# Altium schematic sheet HS-IO Inputs.SchDoc
size A3; SheetNumber: 1; SheetTotal: 3
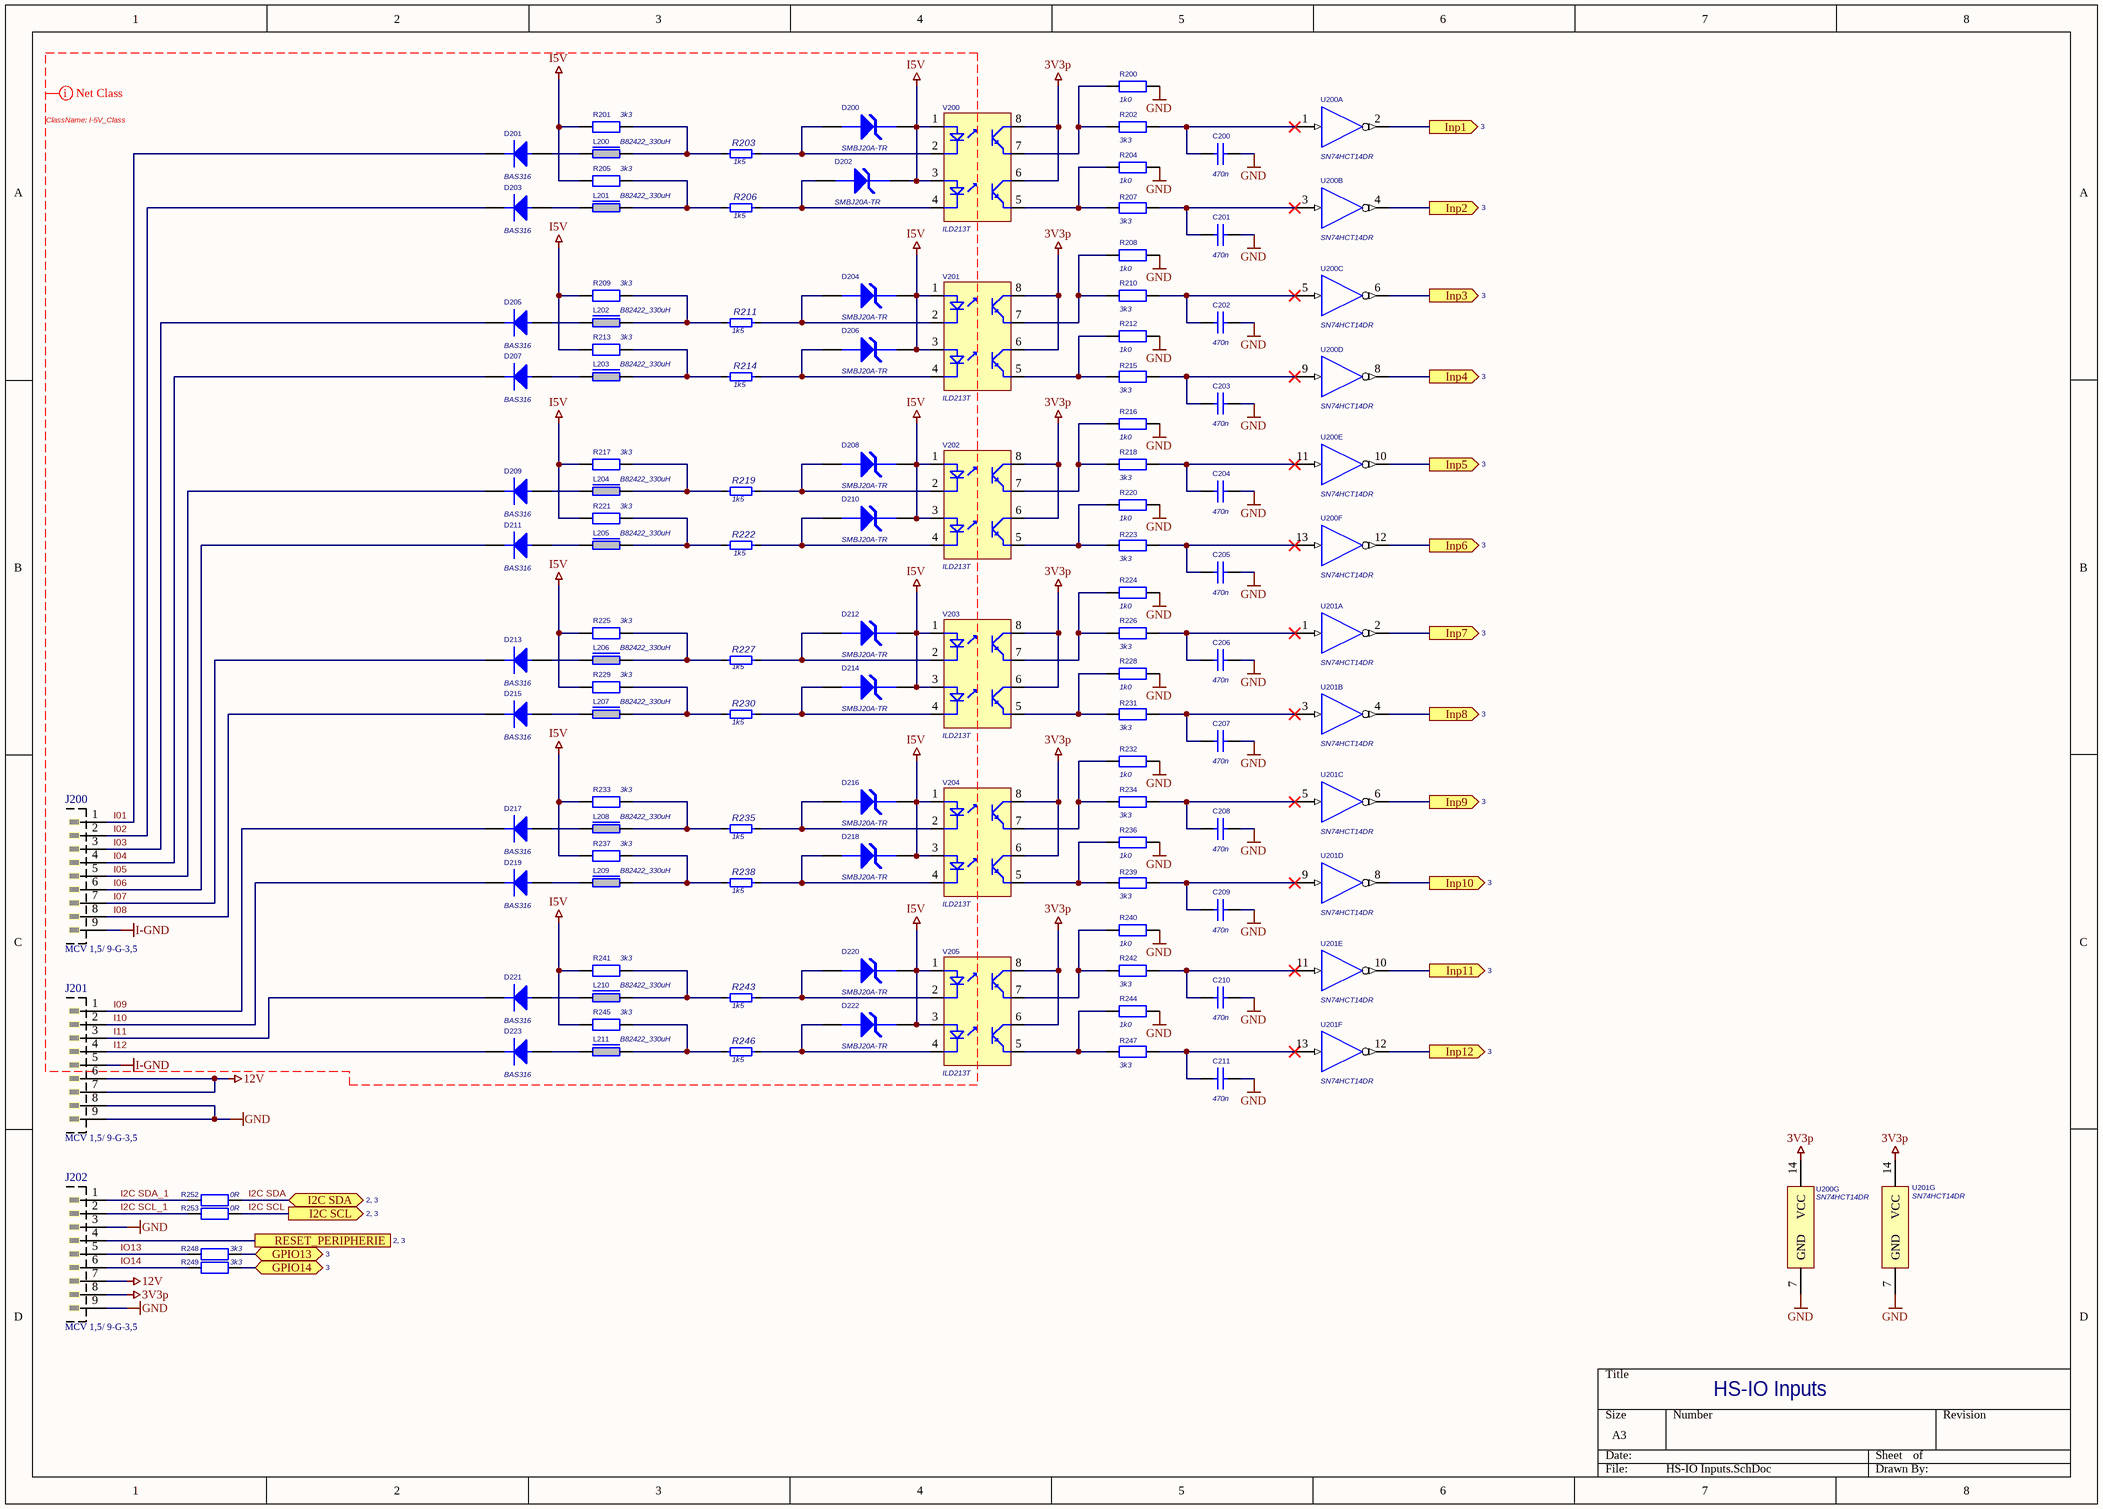
[diagram p0: HS-IO Inputs.SchDoc]

## Parts
C200  470n  [CC1608-0603]
C201  470n  [CC1608-0603]
C202  470n  [CC1608-0603]
C203  470n  [CC1608-0603]
C204  470n  [CC1608-0603]
C205  470n  [CC1608-0603]
C206  470n  [CC1608-0603]
C207  470n  [CC1608-0603]
C208  470n  [CC1608-0603]
C209  470n  [CC1608-0603]
C210  470n  [CC1608-0603]
C211  470n  [CC1608-0603]
D200  SMBJ20A-TR  [SMB]
D201  BAS316  [SOD323F]
D202  SMBJ20A-TR  [SMB]
D203  BAS316  [SOD323F]
D204  SMBJ20A-TR  [SMB]
D205  BAS316  [SOD323F]
D206  SMBJ20A-TR  [SMB]
D207  BAS316  [SOD323F]
D208  SMBJ20A-TR  [SMB]
D209  BAS316  [SOD323F]
D210  SMBJ20A-TR  [SMB]
D211  BAS316  [SOD323F]
D212  SMBJ20A-TR  [SMB]
D213  BAS316  [SOD323F]
D214  SMBJ20A-TR  [SMB]
D215  BAS316  [SOD323F]
D216  SMBJ20A-TR  [SMB]
D217  BAS316  [SOD323F]
D218  SMBJ20A-TR  [SMB]
D219  BAS316  [SOD323F]
D220  SMBJ20A-TR  [SMB]
D221  BAS316  [SOD323F]
D222  SMBJ20A-TR  [SMB]
D223  BAS316  [SOD323F]
J200  MCV 1,5/ 9-G-3,5  [MCV1,5/9-G-3,5 - I]
J201  MCV 1,5/ 9-G-3,5  [MCV1,5/9-G-3,5 - I]
J202  MCV 1,5/ 9-G-3,5  [MCV1,5/9-G-3,5 - I]
L200  B82422_330uH  [CR3225-1210]
L201  B82422_330uH  [CR3225-1210]
L202  B82422_330uH  [CR3225-1210]
L203  B82422_330uH  [CR3225-1210]
L204  B82422_330uH  [CR3225-1210]
L205  B82422_330uH  [CR3225-1210]
L206  B82422_330uH  [CR3225-1210]
L207  B82422_330uH  [CR3225-1210]
L208  B82422_330uH  [CR3225-1210]
L209  B82422_330uH  [CR3225-1210]
L210  B82422_330uH  [CR3225-1210]
L211  B82422_330uH  [CR3225-1210]
R200  1k0  [CR1608-0603]
R201  3k3  [CR1608-0603]
R202  3k3  [CR1608-0603]
R203  1k5  [CR1608-0603]
R204  1k0  [CR1608-0603]
R205  3k3  [CR1608-0603]
R206  1k5  [CR1608-0603]
R207  3k3  [CR1608-0603]
R208  1k0  [CR1608-0603]
R209  3k3  [CR1608-0603]
R210  3k3  [CR1608-0603]
R211  1k5  [CR1608-0603]
R212  1k0  [CR1608-0603]
R213  3k3  [CR1608-0603]
R214  1k5  [CR1608-0603]
R215  3k3  [CR1608-0603]
R216  1k0  [CR1608-0603]
R217  3k3  [CR1608-0603]
R218  3k3  [CR1608-0603]
R219  1k5  [CR1608-0603]
R220  1k0  [CR1608-0603]
R221  3k3  [CR1608-0603]
R222  1k5  [CR1608-0603]
R223  3k3  [CR1608-0603]
R224  1k0  [CR1608-0603]
R225  3k3  [CR1608-0603]
R226  3k3  [CR1608-0603]
R227  1k5  [CR1608-0603]
R228  1k0  [CR1608-0603]
R229  3k3  [CR1608-0603]
R230  1k5  [CR1608-0603]
R231  3k3  [CR1608-0603]
R232  1k0  [CR1608-0603]
R233  3k3  [CR1608-0603]
R234  3k3  [CR1608-0603]
R235  1k5  [CR1608-0603]
R236  1k0  [CR1608-0603]
R237  3k3  [CR1608-0603]
R238  1k5  [CR1608-0603]
R239  3k3  [CR1608-0603]
R240  1k0  [CR1608-0603]
R241  3k3  [CR1608-0603]
R242  3k3  [CR1608-0603]
R243  1k5  [CR1608-0603]
R244  1k0  [CR1608-0603]
R245  3k3  [CR1608-0603]
R246  1k5  [CR1608-0603]
R247  3k3  [CR1608-0603]
R248  3k3  [CR1608-0603]
R249  3k3  [CR1608-0603]
R252  0R  [CR1608-0603]
R253  0R  [CR1608-0603]
U200  SN74HCT14DR  [SO14]  (parts A,B,C,D,E,F,G of 7)
U201  SN74HCT14DR  [SO14]  (parts A,B,C,D,E,F,G of 7)
V200  ILD213T  [SOIC8]
V201  ILD213T  [SOIC8]
V202  ILD213T  [SOIC8]
V203  ILD213T  [SOIC8]
V204  ILD213T  [SOIC8]
V205  ILD213T  [SOIC8]

## Ports
GPIO13 (bidir, see 3), GPIO14 (bidir, see 3), I2C SCL (out, see 2, 3), I2C SDA (bidir, see 2, 3), Inp1 (out, see 3), Inp2 (out, see 3), Inp3 (out, see 3), Inp4 (out, see 3), Inp5 (out, see 3), Inp6 (out, see 3), Inp7 (out, see 3), Inp8 (out, see 3), Inp9 (out, see 3), Inp10 (out, see 3), Inp11 (out, see 3), Inp12 (out, see 3), RESET_PERIPHERIE (see 2, 3)

## Nets
3V3p: J202.8 U200.14(VCC) U201.14(VCC) V200.6 V200.8(Vcc) V201.6 V201.8(Vcc) V202.6 V202.8(Vcc) V203.6 V203.8(Vcc) V204.6 V204.8(Vcc) V205.6 V205.8(Vcc)
12V: J201.6 J201.7 J202.7
GND: C200.2 C201.2 C202.2 C203.2 C204.2 C205.2 C206.2 C207.2 C208.2 C209.2 C210.2 C211.2 J201.8 J201.9 J202.3 J202.9 R200.2 R204.2 R208.2 R212.2 R216.2 R220.2 R224.2 R228.2 R232.2 R236.2 R240.2 R244.2 U200.7(GND) U201.7(GND)
I5V: D200.2(K) D202.2(K) D204.2(K) D206.2(K) D208.2(K) D210.2(K) D212.2(K) D214.2(K) D216.2(K) D218.2(K) D220.2(K) D222.2(K) R201.1 R205.1 R209.1 R213.1 R217.1 R221.1 R225.1 R229.1 R233.1 R237.1 R241.1 R245.1 V200.1 V200.3 V201.1 V201.3 V202.1 V202.3 V203.1 V203.3 V204.1 V204.3 V205.1 V205.3
I-GND: J200.9 J201.5
GPIO13: R248.2 ; port GPIO13
GPIO14: R249.2 ; port GPIO14
I01: D201.2(K) J200.1
I02: D203.2(K) J200.2
I2C SCL: R253.2 ; port I2C SCL
I2C SCL_1: J202.2 R253.1
I2C SDA: R252.2 ; port I2C SDA
I2C SDA_1: J202.1 R252.1
I03: D205.2(K) J200.3
I04: D207.2(K) J200.4
I05: D209.2(K) J200.5
I06: D211.2(K) J200.6
I07: D213.2(K) J200.7
I08: D215.2(K) J200.8
I09: D217.2(K) J201.1
I10: D219.2(K) J201.2
I11: D221.2(K) J201.3
I12: D223.2(K) J201.4
Inp1: U200.2(Y) ; port Inp1
Inp2: U200.4(Y) ; port Inp2
Inp3: U200.6(Y) ; port Inp3
Inp4: U200.8(Y) ; port Inp4
Inp5: U200.10(Y) ; port Inp5
Inp6: U200.12(Y) ; port Inp6
Inp7: U201.2(Y) ; port Inp7
Inp8: U201.4(Y) ; port Inp8
Inp9: U201.6(Y) ; port Inp9
Inp10: U201.8(Y) ; port Inp10
Inp11: U201.10(Y) ; port Inp11
Inp12: U201.12(Y) ; port Inp12
IO13: J202.5 R248.1
IO14: J202.6 R249.1
RESET_PERIPHERIE: J202.4 ; port RESET_PERIPHERIE
NetC200_1: C200.1 R202.2 U200.1(A)
NetC201_1: C201.1 R207.2 U200.3(A)
NetC202_1: C202.1 R210.2 U200.5(A)
NetC203_1: C203.1 R215.2 U200.9(A)
NetC204_1: C204.1 R218.2 U200.11(A)
NetC205_1: C205.1 R223.2 U200.13(A)
NetC206_1: C206.1 R226.2 U201.1(A)
NetC207_1: C207.1 R231.2 U201.3(A)
NetC208_1: C208.1 R234.2 U201.5(A)
NetC209_1: C209.1 R239.2 U201.9(A)
NetC210_1: C210.1 R242.2 U201.11(A)
NetC211_1: C211.1 R247.2 U201.13(A)
NetD200_1: D200.1(A) R203.2 V200.2
NetD201_1: D201.1(A) L200.1
NetD202_1: D202.1(A) R206.2 V200.4
NetD203_1: D203.1(A) L201.1
NetD204_1: D204.1(A) R211.2 V201.2
NetD205_1: D205.1(A) L202.1
NetD206_1: D206.1(A) R214.2 V201.4
NetD207_1: D207.1(A) L203.1
NetD208_1: D208.1(A) R219.2 V202.2
NetD209_1: D209.1(A) L204.1
NetD210_1: D210.1(A) R222.2 V202.4
NetD211_1: D211.1(A) L205.1
NetD212_1: D212.1(A) R227.2 V203.2
NetD213_1: D213.1(A) L206.1
NetD214_1: D214.1(A) R230.2 V203.4
NetD215_1: D215.1(A) L207.1
NetD216_1: D216.1(A) R235.2 V204.2
NetD217_1: D217.1(A) L208.1
NetD218_1: D218.1(A) R238.2 V204.4
NetD219_1: D219.1(A) L209.1
NetD220_1: D220.1(A) R243.2 V205.2
NetD221_1: D221.1(A) L210.1
NetD222_1: D222.1(A) R246.2 V205.4
NetD223_1: D223.1(A) L211.1
NetL200_2: L200.2 R201.2 R203.1
NetL201_2: L201.2 R205.2 R206.1
NetL202_2: L202.2 R209.2 R211.1
NetL203_2: L203.2 R213.2 R214.1
NetL204_2: L204.2 R217.2 R219.1
NetL205_2: L205.2 R221.2 R222.1
NetL206_2: L206.2 R225.2 R227.1
NetL207_2: L207.2 R229.2 R230.1
NetL208_2: L208.2 R233.2 R235.1
NetL209_2: L209.2 R237.2 R238.1
NetL210_2: L210.2 R241.2 R243.1
NetL211_2: L211.2 R245.2 R246.1
NetR200_1: R200.1 R202.1 V200.7
NetR204_1: R204.1 R207.1 V200.5
NetR208_1: R208.1 R210.1 V201.7
NetR212_1: R212.1 R215.1 V201.5
NetR216_1: R216.1 R218.1 V202.7
NetR220_1: R220.1 R223.1 V202.5
NetR224_1: R224.1 R226.1 V203.7
NetR228_1: R228.1 R231.1 V203.5
NetR232_1: R232.1 R234.1 V204.7
NetR236_1: R236.1 R239.1 V204.5
NetR240_1: R240.1 R242.1 V205.7
NetR244_1: R244.1 R247.1 V205.5

## Layout directives
net class I-5V_Class: I01, I02, I03, I04, I05, I5V, I06, I07, I08, I09, I10, I11, I12, I-GND

## Notes on the sheet
- HS-IO Inputs

## Library data of the parts
C200-C211 = CMP-018-000014-2: SMD0603, X7R, 15%, 50V, 470nF; Manufacturer: KEMET; Manufacturer Part Number: C0805C474K5RACAUTO; Kommentar: Kondensator aus mehreren Keramikschichten MLCC - SMD/SMT 50V 0.47uF X7R 0805 10% AEC-Q200; ComponentLink1Description: Manufacturer Link; ComponentLink1URL: https://www.kemet.com; ComponentLink2Description: Datasheet; ComponentLink2URL: https://www.mouser.de/datasheet/2/447/KEM_C1023_X7R_AUTO_SMD-3316698.pdf; Supplier Order Number: 80-C0805C474K5RAUTO; Supplier Price 100pcs: 0,084 €; E01_Value_1: 470n; Supplier: Mouser
D200 D202 D204 D206 D208 D210 D212 D214 D216 D218 D220 D222 = SMBJ20A: 20V UNIDIRECTIONAL TRANSIENT VOLTAGE SUPPRESSOR; Manufacturer: STMicroelectronics; Kommentar: ESD-Entstörer/TVS-Dioden Transil; ComponentLink1Description: Manufacturer Link; ComponentLink1URL: https://www.st.com/; ComponentLink2Description: Datasheet; ComponentLink2URL: https://www.mouser.de/datasheet/2/389/cd00001366-1795574.pdf; E01_Value_1: SMBJ20A-TR; Manufacturer Part Number: SMBJ20A-TR; Supplier: Mouser; Supplier Order Number: 511-SMBJ20A-TR; Supplier Price 100pcs: 0,24 €
D201 D203 D205 D207 D209 D211 D213 D215 D217 D219 D221 D223 = BAS316: Small Signal Fast Switching Diodes 250mA; Manufacturer: Nexperia; Manufacturer Part Number: BAS316,135; Kommentar: Dioden (Allzweck, Leistung, Schaltung) BAS316/SOD323/SOD2; ComponentLink1Description: Manufacturer Link; ComponentLink1URL: https://www.nxp.com/; ComponentLink2Description: Datasheet; ComponentLink2URL: https://www.mouser.de/datasheet/2/916/BAS316-3081362.pdf; E01_Value_1: BAS316; Supplier: Mouser; Supplier Order Number: 771-BAS316135; Supplier Price 100pcs: 0,034 €
J200-J202 = CMP-019-000007-1: Phoneix Contact 9 pole connector Male RM3,5; Manufacturer Part Number: 1843677; Manufacturer: Phoenix Contact; Kommentar: Steckbare Anschlussblöcke 9 Pos 3.5mm pitch Through Hole Header; E01_Value_1: MCV 1,5/ 9-G-3,5; ComponentLink1URL: http://www.phoenixcontact.de/; ComponentLink2Description: Datasheet; Supplier Order Number: 651-1843677; ComponentLink1Description: Manufacturer Link; Supplier Price 100pcs: 2,81 €; ComponentLink2URL: https://www.phoenixcontact.com/us/products/1843677/pdf; Supplier: Mouser
L200-L211 = CMP-023-000002-2: HF-Induktivitäten – SMD SMT-INDUCTOR1210-H 330UH 5%, AEC-Q200; Manufacturer: EPCOS / TDK; Manufacturer Part Number: B82422H1334J000; E01_Value_1: B82422-H1334; ComponentLink1Description: Manufacturer Link; ComponentLink1URL: https://www.tdk-electronics.tdk.com; ComponentLink2Description: Datasheet; ComponentLink2URL: https://product.tdk.com/system/files/dam/doc/product/inductor/inductor/smd/data_sheet/30/db/ind_2008/b82422h.pdf?ref_disty=mouser; Supplier Order Number: 871-B82422H1334J000; Supplier Price 100pcs: 0,32 €; Kommentar: HF-Induktivitäten – SMD SMT-INDUCTOR1210-H 330UH 5%, AEC-Q200; Supplier: Mouser
R200 R204 R208 R212 R216 R220 R224 R228 R232 R236 R240 R244 = S0603_1k0_1_1: SMD0603, 0.1W, TK100, 1%, 1,0k, Metallfilm; Manufacturer: Vishay / Dale; Manufacturer Part Number: CRCW06031K00FKEAC; Kommentar: Dickfilmwiderstände - SMD 1/10Watt 1Kohms 1% Commercial Use; ComponentLink1Description: Manufacturer Link; ComponentLink2Description: Datasheet; ComponentLink2URL: https://www.vishay.com/docs/20035/dcrcwe3.pdf; Supplier: Mouser; Supplier Order Number: 71-CRCW06031K00FKEAC; Supplier Price 100pcs: 0,007 €; E01_Value_1: 1k0; ComponentLink1URL: https://www.vishay.com/
R201 R202 R205 R207 R209 R210 R213 R215 R217 R218 R221 R223 R225 R226 R229 R231 R233 R234 R237 R239 R241 R242 R245 R247-R249 = S0603_3k3_1: Resistor; Manufacturer: Vishay / Dale; Manufacturer Part Number: CRCW06033K30FKEBC; Kommentar: Dickfilmwiderstände - SMD 1/10Watt 3.3Kohms 1% Commercial Use; ComponentLink1Description: Manufacturer Link; ComponentLink1URL: https://www.vishay.com/; ComponentLink2Description: Datasheet; ComponentLink2URL: https://www.vishay.com/docs/20035/dcrcwe3.pdf; E01_Value_1: 3k3; Supplier: Mouser; Supplier Order Number: 71-CRCW06033K30FKEBC; Supplier Price 100pcs: 0,012 €
R203 R206 R211 R214 R219 R222 R227 R230 R235 R238 R243 R246 = CMP-012-000010-3: Resistor; Manufacturer: Vishay / Dale; Manufacturer Part Number: CRCW06031K50FKEAC; Kommentar: Dickfilmwiderstände - SMD 1/10Watt 1.5Kohms 1% Commercial Use; ComponentLink1Description: Manufacturer Link; ComponentLink1URL: https://www.vishay.com/; ComponentLink2Description: Datasheet; ComponentLink2URL: https://www.vishay.com/docs/20035/dcrcwe3.pdf; E01_Value_1: 1k5; Supplier Order Number: 71-CRCW06031K50FKEAC; Supplier Price 100pcs: 0,008 €; Supplier: Mouser
R252 R253 = CMP-038-000000-2: SMD0603, 0.1W, TK100, 1%, 0 Ohm, Metallfilm; Manufacturer Part Number: MCT0603MZ0000ZP500; Manufacturer: Vishay / Beyschlag; Kommentar: Dünnfilmwiderstände - SMD .1W ZEROohm Jumper; ComponentLink1URL: https://www.vishay.com/; Supplier Price 100pcs: 0,052 €; Supplier Order Number: 594-MCT0603MZ0000ZP5; ComponentLink2URL: https://www.vishay.com/docs/28952/mcs0402at-mct0603at-mcu0805at-mca1206at.pdf; ComponentLink2Description: Datasheet; ComponentLink1Description: Manufacturer Link; E01_Value_1: 0R; Supplier: Mouser
U200 U201 = 74HCT14D: Hex Schmitt-Trigger Inverter; Manufacturer: Texas Instruments; Kommentar: Inverter Hex Schmitt-Trigger Inverter; ComponentLink1Description: Manufacturer Link; ComponentLink1URL: https://www.nxp.com/; ComponentLink2Description: Datasheet; ComponentLink2URL: https://www.ti.com/lit/gpn/sn74hct14; E01_Value_1: SN74HCT14DR; Manufacturer Part Number: SN74HCT14DR; Supplier: Mouser; Supplier Order Number: 595-SN74HCT14DR; Supplier Price 100pcs: 0,119 €
V200-V205 = ILD213T: Dual SMD Optocoupler CTR > 100%; Manufacturer: Vishay Semiconductors; Kommentar: Transistor-Ausgangsoptokoppler Phototransistor Out Dual CTR >100%; ComponentLink1Description: Manufacturer Link; ComponentLink1URL: https://www.vishay.com/; ComponentLink2Description: Datasheet; ComponentLink2URL: https://www.vishay.com/doc?83647; E01_Value_1: ILD213T; Manufacturer Part Number: ILD213T; Supplier: Mouser; Supplier Order Number: 782-ILD213T; Supplier Price 100pcs: 0,586 €